# EAGLE design Temperature (EAGLE 6.3)
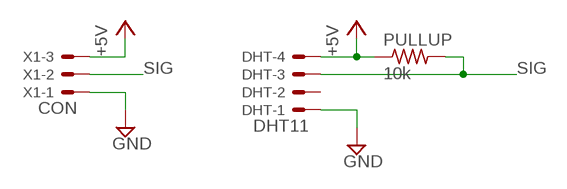
[diagram p0: schematic, sheet 1]

## Parts
DHT  DHT11  22-23-2041  [22-23-2041]
PULLUP  10k  R-US_0204/7  [0204/7]
X1  CON  22-23-2031  [22-23-2031]

## Nets
+5V: DHT.4 PULLUP.1 X1.3
GND: DHT.1 X1.1
SIG: DHT.3 PULLUP.2 X1.2
Unconnected: DHT.2

## Library data of the parts
DHT = con-molex:22-23-2041: .100" (2.54mm) Center Header - 4 Pin; MF: MOLEX; MPN: 22-23-2041; OC_FARNELL: 1462920; OC_NEWARK: 38C0355
PULLUP = adafruit:R-US_: RESISTOR, American symbol
X1 = con-molex:22-23-2031: .100" (2.54mm) Center Header - 3 Pin; MF: MOLEX; MPN: 22-23-2031; OC_FARNELL: 1462950; OC_NEWARK: 30C0862

## Board
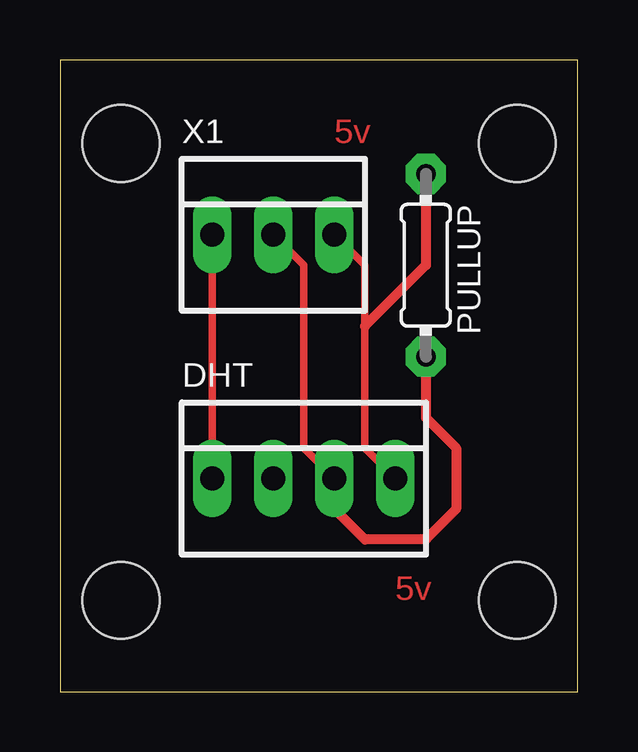
[diagram p1: board, top side]

Size 21.57 x 26.34 mm. Coordinates in mm from the lower left corner, seen from the top.
Outline: 0,0 21.57,0 21.57,26.34 0,26.34 0,0
Copper layers (1*16): Top 0.035mm / dielectric 1.5mm / Bottom 0.035mm
Design rules "CUSTOM": minimum track width 12mil, minimum drill 20mil, track to track 12mil, track to pad 12mil, pad to pad 12mil, via to via 8mil, smd to smd 8mil, copper to edge 12mil, drill to drill 12mil, minimum pad ring 12mil, minimum via ring 12mil, stop-mask expansion 4mil, vias tented up to drill 25mil, thermal gap 10mil
Holes 3.2 mm at 19.05,22.86 19.05,3.81 2.54,22.86 2.54,3.81

### Footprints (pad centres in the part's own frame; a part is rotated, then mirrored left to right if it is on the bottom)
22-23-2041 = drill 1 long: 1 -3.81,0; 2 -1.27,0; 3 1.27,0; 4 3.81,0
0204/7 = drill 0.813 pad 1.676 octagon: 1 -3.81,0; 2 3.81,0
22-23-2031 = drill 1 long: 1 -2.54,0; 2 0,0; 3 2.54,0

### Placement (x,y rotation side)
DHT  10.16,8.89 0 top
PULLUP  15.24,17.78 270 top
X1  8.89,19.05 0 top

### Tracks (layer width: path | path; a pad name or v marks a point on that pad's centre or on a via)
+5V
  Top 0.305: DHT.4 12.7,10.16 12.7,15.24 12.7,17.78 X1.3
  Top 0.406: PULLUP.1 15.24,17.78 12.7,15.24
GND
  Top 0.305: X1.1 DHT.1
SIG
  Top 0.305: DHT.3 10.16,10.16 10.16,17.78 X1.2
  Top 0.406: PULLUP.2 15.24,11.43 16.51,10.16 16.51,7.62 15.24,6.35 12.7,6.35 11.43,7.62 DHT.3

### Text on the board
Top: 5v | 5v